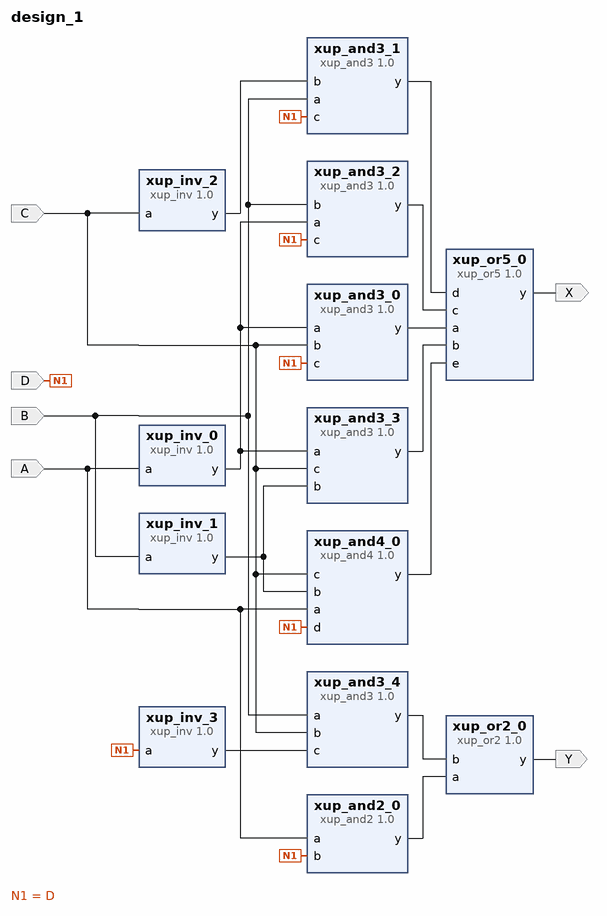
[diagram p0: block diagram of the top level]
# Vivado block design design_1, xc7a35tcpg236-1, Vivado 2023.1
create_bd_design design_1

create_bd_port -dir I A
create_bd_port -dir I B
create_bd_port -dir I C
create_bd_port -dir I D
create_bd_port -dir O X
create_bd_port -dir O Y

create_bd_cell -type ip -vlnv xilinx.com:XUP:xup_inv:1.0 xup_inv_0
create_bd_cell -type ip -vlnv xilinx.com:XUP:xup_inv:1.0 xup_inv_1
create_bd_cell -type ip -vlnv xilinx.com:XUP:xup_inv:1.0 xup_inv_2
create_bd_cell -type ip -vlnv xilinx.com:XUP:xup_inv:1.0 xup_inv_3
create_bd_cell -type ip -vlnv xilinx.com:XUP:xup_and3:1.0 xup_and3_0
create_bd_cell -type ip -vlnv xilinx.com:XUP:xup_and3:1.0 xup_and3_1
create_bd_cell -type ip -vlnv xilinx.com:XUP:xup_and3:1.0 xup_and3_2
create_bd_cell -type ip -vlnv xilinx.com:XUP:xup_and3:1.0 xup_and3_3
create_bd_cell -type ip -vlnv xilinx.com:XUP:xup_and4:1.0 xup_and4_0
create_bd_cell -type ip -vlnv xilinx.com:XUP:xup_or5:1.0 xup_or5_0
create_bd_cell -type ip -vlnv xilinx.com:XUP:xup_and2:1.0 xup_and2_0
create_bd_cell -type ip -vlnv xilinx.com:XUP:xup_and3:1.0 xup_and3_4
create_bd_cell -type ip -vlnv xilinx.com:XUP:xup_or2:1.0 xup_or2_0

# ---- connections ----

connect_bd_net [get_bd_ports A] [get_bd_pins xup_inv_0/a] [get_bd_pins xup_and4_0/a] [get_bd_pins xup_and2_0/a]
connect_bd_net [get_bd_ports B] [get_bd_pins xup_inv_1/a] [get_bd_pins xup_and3_2/b] [get_bd_pins xup_and3_1/a] [get_bd_pins xup_and3_4/a]
connect_bd_net [get_bd_ports C] \
  [get_bd_pins xup_inv_2/a] [get_bd_pins xup_and3_0/b] [get_bd_pins xup_and3_3/c] [get_bd_pins xup_and4_0/c] \
  [get_bd_pins xup_and3_4/b]
connect_bd_net [get_bd_ports D] \
  [get_bd_pins xup_inv_3/a] [get_bd_pins xup_and3_0/c] [get_bd_pins xup_and3_2/c] [get_bd_pins xup_and3_1/c] \
  [get_bd_pins xup_and4_0/d] [get_bd_pins xup_and2_0/b]
connect_bd_net [get_bd_pins xup_and2_0/y] [get_bd_pins xup_or2_0/a]
connect_bd_net [get_bd_pins xup_and3_0/y] [get_bd_pins xup_or5_0/a]
connect_bd_net [get_bd_pins xup_and3_1/y] [get_bd_pins xup_or5_0/d]
connect_bd_net [get_bd_pins xup_and3_2/y] [get_bd_pins xup_or5_0/c]
connect_bd_net [get_bd_pins xup_and3_3/y] [get_bd_pins xup_or5_0/b]
connect_bd_net [get_bd_pins xup_and3_4/y] [get_bd_pins xup_or2_0/b]
connect_bd_net [get_bd_pins xup_and4_0/y] [get_bd_pins xup_or5_0/e]
connect_bd_net [get_bd_pins xup_inv_0/y] [get_bd_pins xup_and3_0/a] [get_bd_pins xup_and3_3/a] [get_bd_pins xup_and3_2/a]
connect_bd_net [get_bd_pins xup_inv_1/y] [get_bd_pins xup_and3_3/b] [get_bd_pins xup_and4_0/b]
connect_bd_net [get_bd_pins xup_inv_2/y] [get_bd_pins xup_and3_1/b]
connect_bd_net [get_bd_pins xup_inv_3/y] [get_bd_pins xup_and3_4/c]
connect_bd_net [get_bd_pins xup_or2_0/y] [get_bd_ports Y]
connect_bd_net [get_bd_pins xup_or5_0/y] [get_bd_ports X]

validate_bd_design
save_bd_design
